# Altium schematic sheet as14120_x31_power.SchDoc
size A3; PageSetup: Record=PageOptions|CenterHorizontal=True|CenterVertical=True|PrintScale=3.75|XCorrection=1.00|YCorrection=1.00|PrintKind=0|BorderSize=5000000|LeftOffset=0|BottomOffset=0|Orientation=2|PaperLength=1000|PaperWidth=1000|Scale=100|PaperSource=7|PrintQuality=-4|MediaType=1|DitherType=10|PaperKind=A4 (210 x 297 мм)|PrintScaleMode=1
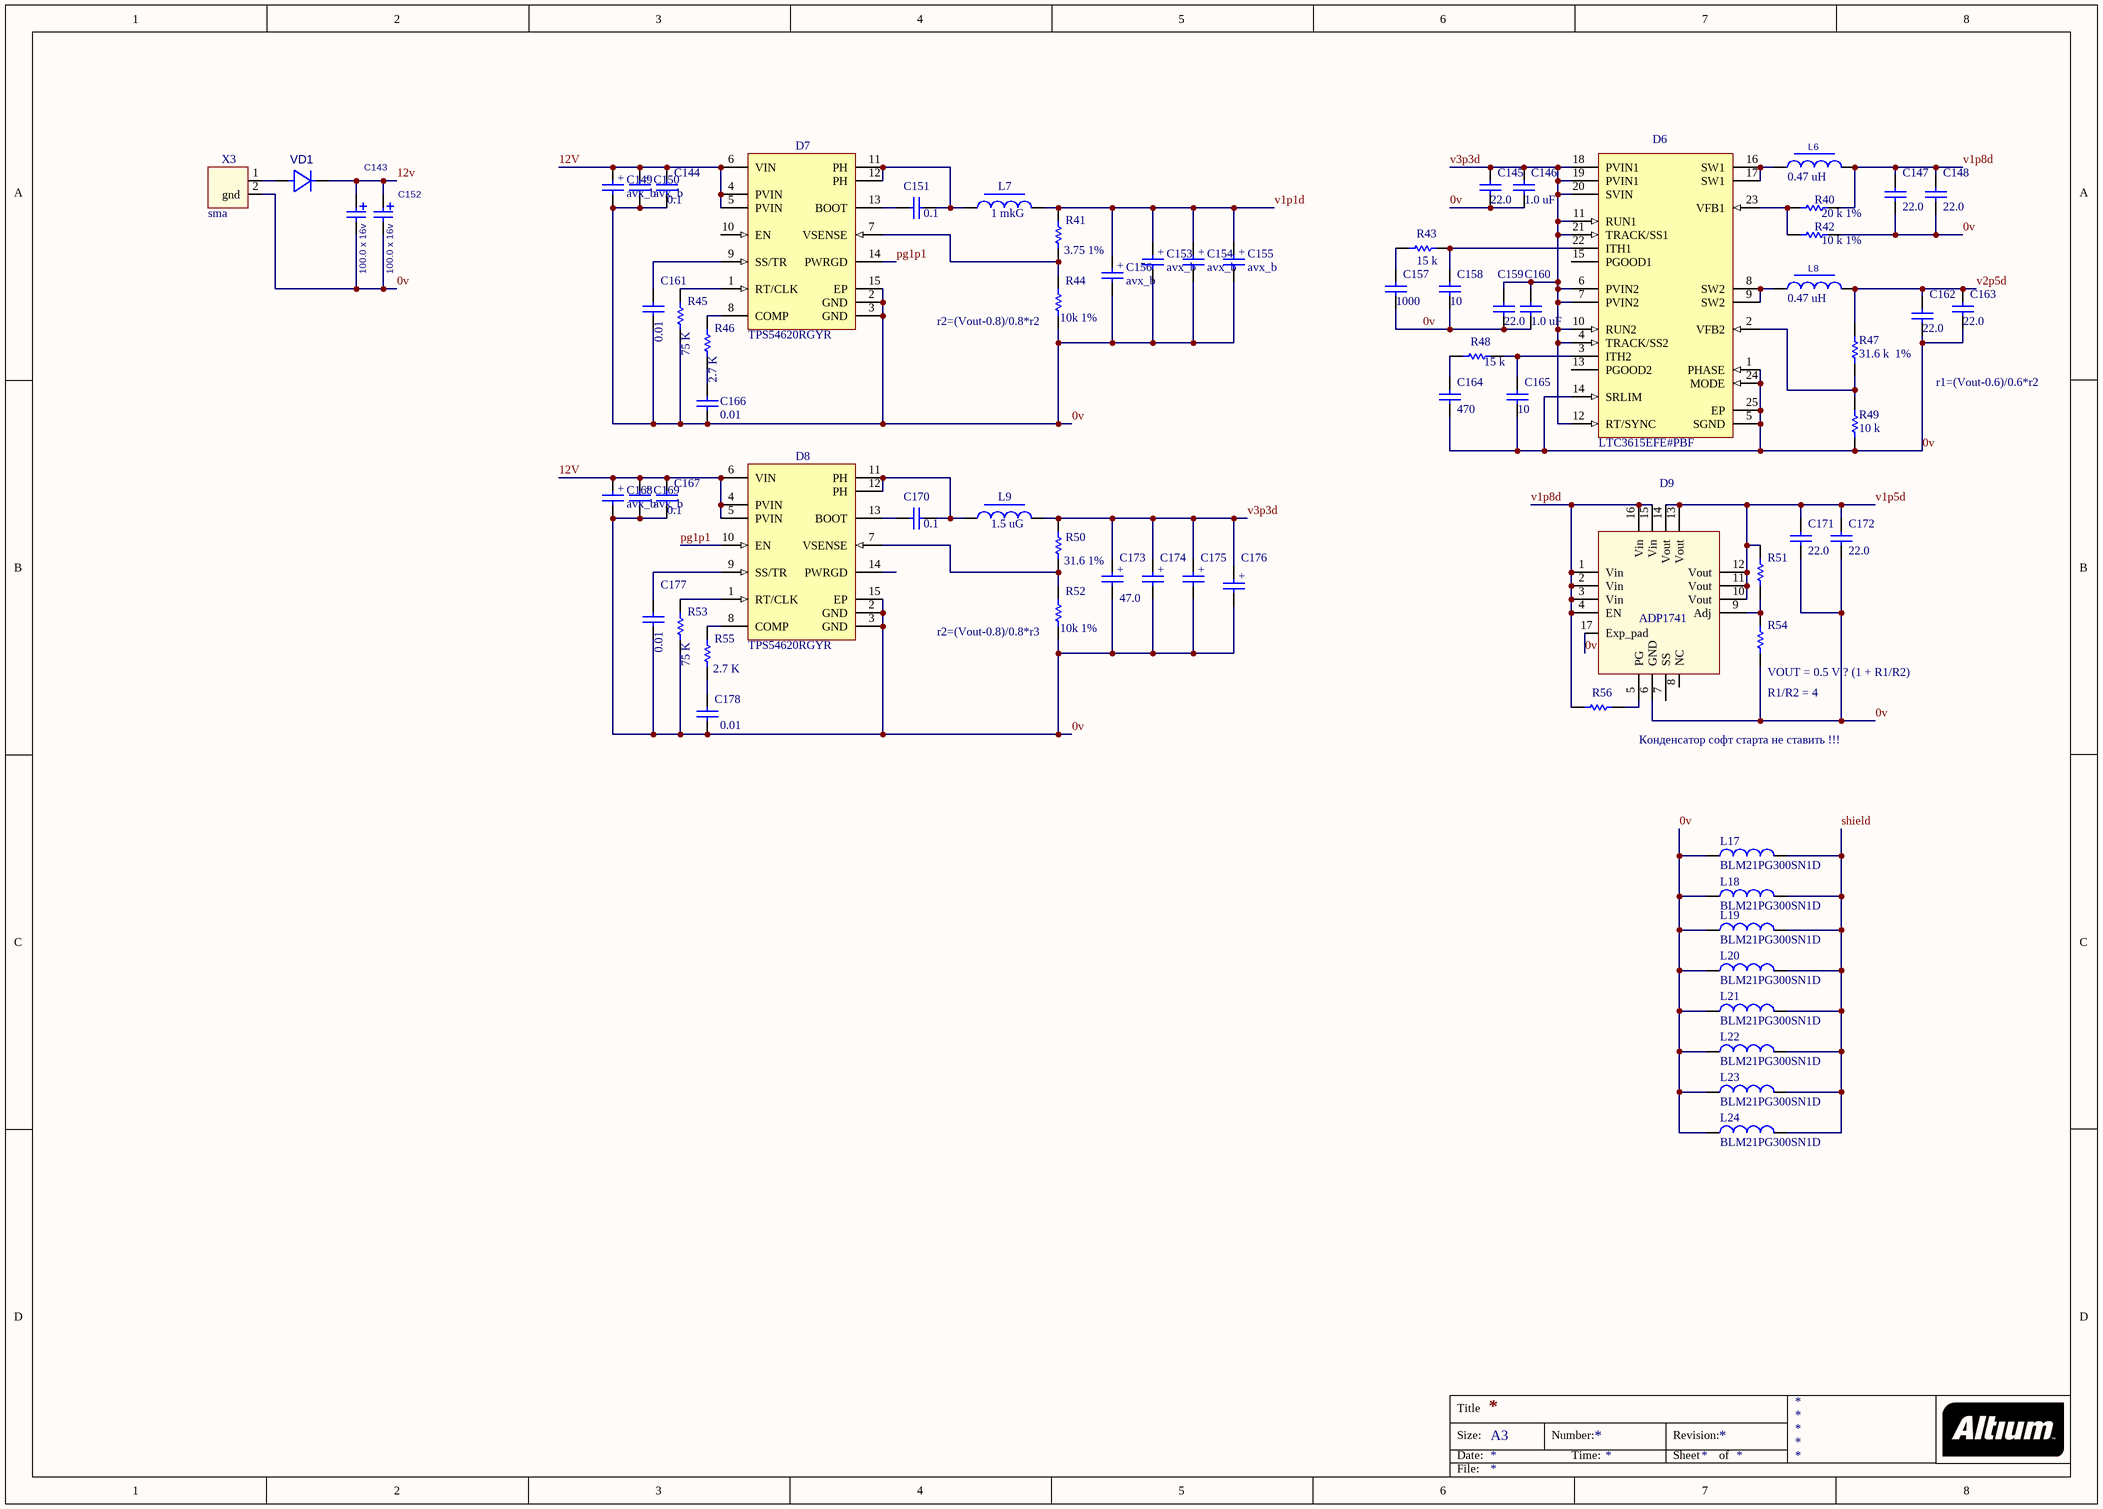
[diagram p0: as14120_x31_power.SchDoc]

## Parts
C143  value 100.0 x 16v  [AVX_D]  (hidden comment: AVX_D)
C144  value 0.1  [CAPC0805(2012)100_N]  (hidden comment: CAP_0805)
C145  value 22.0  [CAPC0805(2012)100_N]  (hidden comment: CAP_0805)
C146  value 1.0 uF  [CAPC0805(2012)100_N]  (hidden comment: CAP_0805)
C147  value 22.0  [CAPC0805(2012)100_N]  (hidden comment: CAP_0805)
C148  value 22.0  [CAPC0805(2012)100_N]  (hidden comment: CAP_0805)
C149  avx_b  [avx_b]
C150  avx_b  [avx_b]
C151  value 0.1  [CAPC0805(2012)100_N]  (hidden comment: CAP_0805)
C152  value 100.0 x 16v  [AVX_D]  (hidden comment: AVX_D)
C153  avx_b  [avx_b]
C154  avx_b  [avx_b]
C155  avx_b  [avx_b]
C156  avx_b  [avx_b]
C157  value 1000  [CAPC0805(2012)100_N]  (hidden comment: CAP_0805)
C158  value 10  [CAPC0805(2012)100_N]  (hidden comment: CAP_0805)
C159  value 22.0  [CAPC0805(2012)100_N]  (hidden comment: CAP_0805)
C160  value 1.0 uF  [CAPC0805(2012)100_N]  (hidden comment: CAP_0805)
C161  value 0.01  [CAPC0805(2012)100_N]  (hidden comment: CAP_0805)
C162  value 22.0  [CAPC0805(2012)100_N]  (hidden comment: CAP_0805)
C163  value 22.0  [CAPC0805(2012)100_N]  (hidden comment: CAP_0805)
C164  value 470  [CAPC0805(2012)100_N]  (hidden comment: CAP_0805)
C165  value 10  [CAPC0805(2012)100_N]  (hidden comment: CAP_0805)
C166  value 0.01  [CAPC0805(2012)100_N]  (hidden comment: CAP_0805)
C167  value 0.1  [CAPC0805(2012)100_N]  (hidden comment: CAP_0805)
C168  avx_b  [avx_b]
C169  avx_b  [avx_b]
C170  value 0.1  [CAPC0805(2012)100_N]  (hidden comment: CAP_0805)
C171  value 22.0  [CAPC0805(2012)100_N]  (hidden comment: CAP_0805)
C172  value 22.0  [CAPC0805(2012)100_N]  (hidden comment: CAP_0805)
C173  value 47.0  [avx_b]  (hidden comment: avx_b)
C174  avx_b  [avx_b]  (value not drawn)
C175  avx_b  [avx_b]  (value not drawn)
C176  avx_b  [avx_b]  (value not drawn)
C177  value 0.01  [CAPC0805(2012)100_N]  (hidden comment: CAP_0805)
C178  value 0.01  [CAPC0805(2012)100_N]  (hidden comment: CAP_0805)
D6  LTC3615EFE#PBF  [LT-FE-24-EPV-AA_N]
D7  TPS54620RGYR  [RGY14-2050X2050TP]
D8  TPS54620RGYR  [RGY14-2050X2050TP]
D9  ADP1741  [CP-16-4_N]
L6  value 0.47 uH  [IND_Sumida_CDRH3D16]  (hidden comment: IND_Sumida_CDRH3D16)
L7  value 1 mkG  [IND_CDR127_Sumida]  (hidden comment: ind_cdr127_sumida)
L8  value 0.47 uH  [IND_Sumida_CDRH3D16]  (hidden comment: IND_Sumida_CDRH3D16)
L9  value 1.5 uG  [IND_CDR127_Sumida]  (hidden comment: ind_cdr127_sumida)
L17  BLM21PG300SN1D  [CAPC0805(2012)100_N]
L18  BLM21PG300SN1D  [CAPC0805(2012)100_N]
L19  BLM21PG300SN1D  [CAPC0805(2012)100_N]
L20  BLM21PG300SN1D  [CAPC0805(2012)100_N]
L21  BLM21PG300SN1D  [CAPC0805(2012)100_N]
L22  BLM21PG300SN1D  [CAPC0805(2012)100_N]
L23  BLM21PG300SN1D  [CAPC0805(2012)100_N]
L24  BLM21PG300SN1D  [CAPC0805(2012)100_N]
R40  value 20 k 1%  [RESC0805(2012)_L]  (hidden comment: 1K 1% 0805(2012))
R41  value 3.75 1%  [RESC0805(2012)_L]  (hidden comment: 1K 1% 0805(2012))
R42  value 10 k 1%  [RESC0805(2012)_L]  (hidden comment: 1K 1% 0805(2012))
R43  value 15 k  [RESC0805(2012)_L]  (hidden comment: 1K 1% 0805(2012))
R44  value 10k 1%  [RESC0805(2012)_L]  (hidden comment: 1K 1% 0805(2012))
R45  value 75 K  [RESC0805(2012)_L]  (hidden comment: 1K 1% 0805(2012))
R46  value 2.7 K  [RESC0805(2012)_L]  (hidden comment: 1K 1% 0805(2012))
R47  value 31.6 k  1%  [RESC0805(2012)_L]  (hidden comment: 1K 1% 0805(2012))
R48  value 15 k  [RESC0805(2012)_L]  (hidden comment: 1K 1% 0805(2012))
R49  value 10 k  [RESC0805(2012)_L]  (hidden comment: 1K 1% 0805(2012))
R50  value 31.6 1%  [RESC0805(2012)_L]  (hidden comment: 1K 1% 0805(2012))
R51  1K 1% 0805(2012)  [RESC0805(2012)_L]  (value not drawn)
R52  value 10k 1%  [RESC0805(2012)_L]  (hidden comment: 1K 1% 0805(2012))
R53  value 75 K  [RESC0805(2012)_L]  (hidden comment: 1K 1% 0805(2012))
R54  1K 1% 0805(2012)  [RESC0805(2012)_L]  (value not drawn)
R55  value 2.7 K  [RESC0805(2012)_L]  (hidden comment: 1K 1% 0805(2012))
R56  1K 5% 0603(1608)  [RESC0603(1608)_L]  (value not drawn)
VD1  30BQ60  [SMC]  (value not drawn)
X3  sma  [sma]

## Nets
0v: C143.2 C144.2 C145.1 C146.1 C147.1 C148.1 C149.2 C150.2 C152.2 C153.2 C154.2 C155.2 C156.2 C157.1 C158.1 C159.1 C160.1 C161.1 C162.1 C163.1 C164.1 C165.1 C166.1 C167.2 C168.2 C169.2 C171.1 C172.1 C173.2 C174.2 C175.2 C176.2 C177.1 C178.1 D6.1(PHASE) D6.5(SGND) D6.14(SRLIM) D6.24(MODE) D6.25(EP) D7.2(GND) D7.3(GND) D7.15(EP) D8.2(GND) D8.3(GND) D8.15(EP) D9.6(GND) D9.17(Exp_pad) L17.1 L18.1 L19.1 L20.1 L21.1 L22.1 L23.1 L24.1 R42.2 R44.1 R45.2 R49.1 R52.1 R53.2 R54.1 X3.2(gnd)
12V: C143.1 C144.1 C149.1 C150.1 C152.1 C167.1 C168.1 C169.1 D7.4(PVIN) D7.5(PVIN) D7.6(VIN) D8.4(PVIN) D8.5(PVIN) D8.6(VIN) VD1.1
pg1p1: D7.14(PWRGD) D8.10(EN)
shield: L17.2 L18.2 L19.2 L20.2 L21.2 L22.2 L23.2 L24.2
v1p1d: C153.1 C154.1 C155.1 C156.1 L7.2 R41.2
v1p5d: C171.2 C172.2 D9.10(Vout) D9.11(Vout) D9.12(Vout) D9.13(Vout) D9.14(Vout) R51.2
v1p8d: C147.2 C148.2 D9.1(Vin) D9.2(Vin) D9.3(Vin) D9.4(EN) D9.15(Vin) D9.16(Vin) L6.2 R40.2 R56.2
v2p5d: C162.2 C163.2 L8.2 R47.2
v3p3d: C145.2 C146.2 C159.2 C160.2 C173.1 C174.1 C175.1 C176.1 D6.4(TRACK/SS2) D6.6(PVIN2) D6.7(PVIN2) D6.10(RUN2) D6.11(RUN1) D6.12(RT/SYNC) D6.18(PVIN1) D6.19(PVIN1) D6.20(SVIN) D6.21(TRACK/SS1) L9.2 R50.2
NetC151_1: C151.1 D7.13(BOOT)
NetC151_2: C151.2 D7.11(PH) D7.12(PH) L7.1
NetC157_2: C157.2 R43.1
NetC158_2: C158.2 D6.22(ITH1) R43.2
NetC161_2: C161.2 D7.9(SS/TR)
NetC164_2: C164.2 R48.1
NetC165_2: C165.2 D6.3(ITH2) R48.2
NetC166_2: C166.2 R46.2
NetC170_1: C170.1 D8.13(BOOT)
NetC170_2: C170.2 D8.11(PH) D8.12(PH) L9.1
NetC177_2: C177.2 D8.9(SS/TR)
NetC178_2: C178.2 R55.2
NetD6_2: D6.2(VFB2) R47.1 R49.2
NetD6_8: D6.8(SW2) D6.9(SW2) L8.1
NetD6_16: D6.16(SW1) D6.17(SW1) L6.1
NetD6_23: D6.23(VFB1) R40.1 R42.1
NetD7_1: D7.1(RT/CLK) R45.1
NetD7_7: D7.7(VSENSE) R41.1 R44.2
NetD7_8: D7.8(COMP) R46.1
NetD8_1: D8.1(RT/CLK) R53.1
NetD8_7: D8.7(VSENSE) R50.1 R52.2
NetD8_8: D8.8(COMP) R55.1
NetD9_5: D9.5(PG) R56.1
NetD9_9: D9.9(Adj) R51.1 R54.2
NetVD1_2: VD1.2 X3.1

Not connected (* = marked no-connect by the designer): D6 13(PGOOD2) 15(PGOOD1); D7 10(EN); D8 14(PWRGD); D9 7(SS) 8(NC)

## Notes on the sheet
- (near R44) r2=(Vout-0.8)/0.8*r2
- r1=(Vout-0.6)/0.6*r2
- (near R52) r2=(Vout-0.8)/0.8*r3
- (near R54) VOUT = 0.5 V ? (1 + R1/R2)
- R1/R2 = 4
- Конденсатор софт старта не ставить !!!
- Title
- Size:
- Date:
- A3
- Number:
- Time:
- Revision:
- Sheet
- of
- File:
- (in symbol avx_b) +

## Library data of the parts
D6 = LTC3615EFE#PBF: Dual 4 MHz, 3 A Synchronous Step-Down DC/DC Converter, 24-pin SOP (FE-24-EPV-AA), -40 to 125 degC, Pb-Free; Manufacturer: Linear Technology; Frequency Adjust Range: Up - 4MHz; Number of Outputs: 2; DatasheetVersion: Rev. B; PackageVersion: Rev. B, 09/2010; PackageReference: FE-24; PackageDescription: 24-Pin Plastic TSSOP, Body 7.8 x 4.4 mm, Pitch 0.65 mm; Supplier 1: Digi-Key; Supplier Part Number 1: LTC3615EFE#PBF-ND; Supplier 2: Farnell; Supplier Part Number 2: 1839098; RoHS: TRUE; Mounting Technology: Surface Mount; PartNumber: LTC3615EFE#PBF; ComponentLink1Description: Manufacturer URL; ComponentLink1URL: http://www.linear.com/; ComponentLink2Description: Datasheet; ComponentLink2URL: http://cds.linear.com/docs/en/datasheet/3615fb.pdf; ComponentLink3Description: Package Specification; ComponentLink3URL: http://cds.linear.com/docs/en/packaging/TSSOP_24_05-08-1771.pdf
D7 D8 = TPS54620RGYR: Buck Step Down Regulator with 4.5 to 17 V Input and 0.8 to 15 V Output, -40 to 150 degC, 14-Pin VQFN (RGY), Green (RoHS & no Sb/Br); Manufacturer: Texas Instruments; Duty Cycle(Max)(%): 98; Iout(Max)(A): 6; Iq(Typ)(mA): 0.6; Rating: Catalog; Regulated Outputs(#): 1; SubFamily: Step-Down Regulator; Switch Current Limit(Typ)(A): 8; Synchronous Rectification: TRUE; Vin(Max)(V): 17; Vin(Min)(V): 4.5; Vout(Max)(V): 15; Vout(Min)(V): 0.8; DatasheetVersion: SLVS949C; PackageVersion: revI, Jun-2011; PackageReference: RGY14-2050X2050TP; PackageDescription: 14-Leads Plastic Quad Flatpack No-Lead, 3.5 x 3.5 x 0.9 mm Body, 0.5 mm Pitch; Supplier 1: Digi-Key; Supplier Part Number 1: 296-24554-2-ND; Supplier 2: Digi-Key; Supplier Part Number 2: 296-24554-1-ND; Supplier 3: Digi-Key; Supplier Part Number 3: 296-24554-6-ND; Supplier 4: Newark; Supplier Part Number 4: 25R0106; Supplier 5: Mouser; Supplier Part Number 5: 595-TPS54620RGYR; Eco-Plan: Green (RoHS & no Sb/Br); Topology: Buck; Mounting Technology: Surface Mount; Code_JEDEC: MO-241-BA; PartNumber: TPS54620RGYR; ComponentLink1Description: Datasheet; ComponentLink1URL: http://www.ti.com/general/docs/lit/getliterature.tsp?genericPartNumber=TPS54620&fileType=pdf; ComponentLink2Description: Package Specification; ComponentLink2URL: http://www.ti.com/litv/pdf/mpqf114g; ComponentLink3Description: URL Link1; ComponentLink3URL: Samples URL:http://www.ti.com/product/tps54620#samples
L6 L8 = IND_Sumida_CDRH3D16: INDUCT
L17-L24 = Ferrite_beat
R40-R50 R52 R53 R55 = RES_0805: 1K 0.125W 1% 0805 (2012 Metric)  SMD; Case-Metric: 2012; Case-EIA: 0805; Tolerance: 1 %; Power: 0.125 W; Technology: SMT
R51 R54 = RES_0805: 1K 0.125W 1% 0805 (2012 Metric)  SMD; Case-Metric: 2012; Value: 1000.00 Ohm; Case-EIA: 0805; Tolerance: 1 %; Power: 0.125 W; Technology: SMT
R56 = RES_0603: 1K 0.1W 5% 0603 (1608 Metric)  SMD; Case-EIA: 0603; Case-Metric: 1608; Value: 1000.00 Ohm; Technology: SMT; Tolerance: 5 %; Power: 0.1 W
VD1 = 30BQ60: Value: {Value}